# Altium project Pico-Pal.PrjPcb
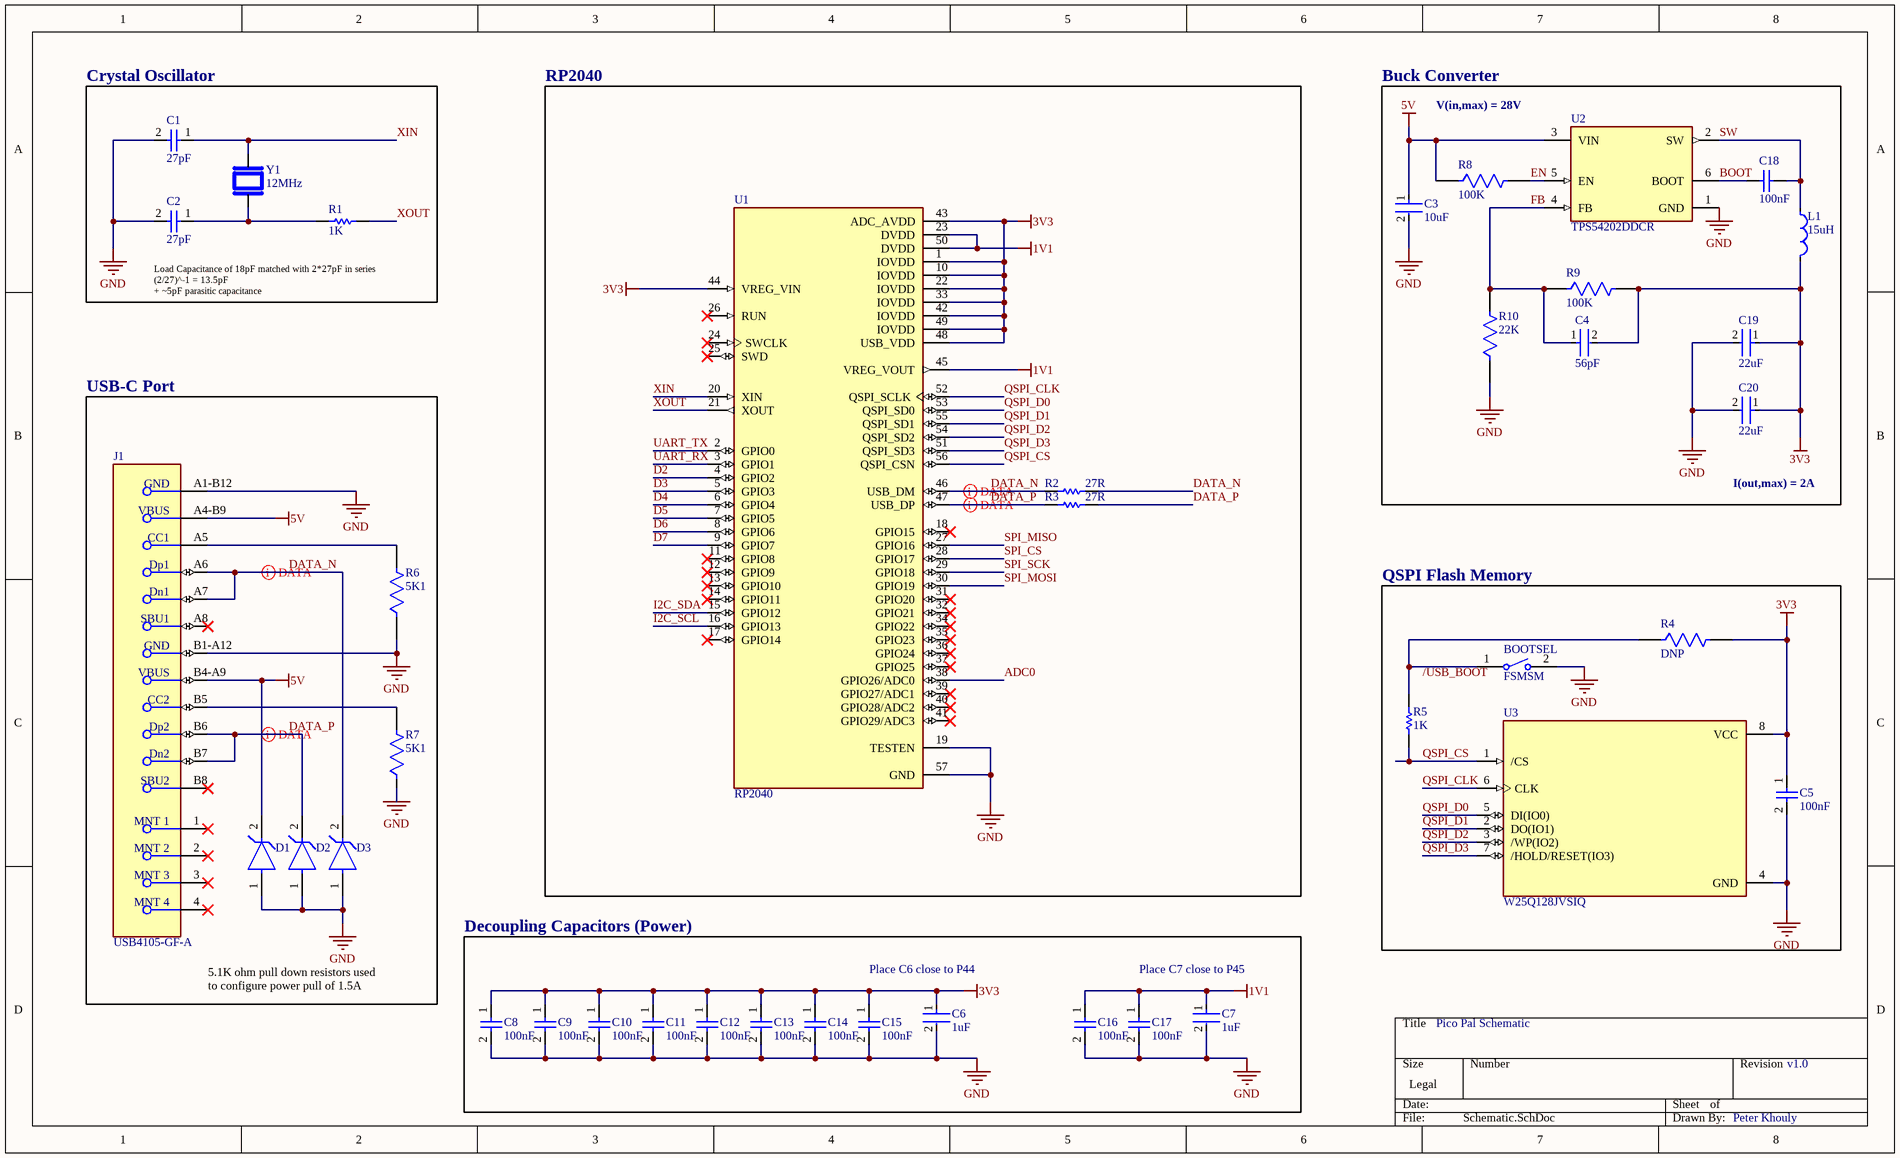
[diagram p0: Schematic.SchDoc]
1 sheet, 40 parts. Net scope: global (net labels, ports and power ports of the same name join across sheets).
Board file: PCB1.PcbDoc

## Sheet Schematic.SchDoc
size Legal; SheetNumber: 1; SheetTotal: 1

### Parts
BOOTSEL  FSMSM  [TECO-FSMSM-2_V]
C1  27pF  [CAPC1005X55X25LL05T10]
C2  27pF  [CAPC1005X55X25LL05T10]
C3  10uF  [FP-GRM15-0_2-MFG]
C4  56pF  [FP-0402-L_1_0_1-W_0_5_0_1-MFG]
C5  100nF  [CAPC1005X56X25LL10T15]
C6  1uF  [FP-GRM15-0_1-MFG]
C7  1uF  [FP-GRM15-0_1-MFG]
C8  100nF  [CAPC1005X56X25LL10T15]
C9  100nF  [CAPC1005X56X25LL10T15]
C10  100nF  [CAPC1005X56X25LL10T15]
C11  100nF  [CAPC1005X56X25LL10T15]
C12  100nF  [CAPC1005X56X25LL10T15]
C13  100nF  [CAPC1005X56X25LL10T15]
C14  100nF  [CAPC1005X56X25LL10T15]
C15  100nF  [CAPC1005X56X25LL10T15]
C16  100nF  [CAPC1005X56X25LL10T15]
C17  100nF  [CAPC1005X56X25LL10T15]
C18  100nF  [CAPC1005X56X25LL10T15]
C19  22uF  [FP-CL746-IPC_C]
C20  22uF  [FP-CL746-IPC_C]
D1  (no value)  [FP-SLP1006P2-MFG]
D2  (no value)  [FP-SLP1006P2-MFG]
D3  (no value)  [FP-SLP1006P2-MFG]
J1  USB4105-GF-A  [FP-USB4105-GF-A-MFG]
L1  15uH  [FP-MLZ2012-1_25-IPC_B]
R1  1K  [RESC1005X40X25NL05T05]
R2  27R  [RESC1005X40X25LL05T05]
R3  27R  [RESC1005X40X25LL05T05]
R4  DNP  [FP-CRCW1206-e3-IPC_C]
R5  1K  [RESC1005X40X25NL05T05]
R6  5K1  [FP-ERJ2RK-IPC_A]
R7  5K1  [FP-ERJ2RK-IPC_A]
R8  100K  [FP-ERJ2RK-IPC_C]
R9  100K  [FP-ERJ2RK-IPC_C]
R10  22K  [FP-ERJ2RK-MFG]
U1  RP2040  [QFN40P700X700X90-57N]
U2  TPS54202DDCR  [FP-DDC0006A-IPC_B]
U3  W25Q128JVSIQ  [SOIC127P790X216-8N]
Y1  12MHz  [XTAL_ABLS-12.000MHZ-B4-T]

### Blocks framed on the sheet
Crystal Oscillator: C1 C2 R1 Y1
RP2040: R2 R3 U1
Buck Converter: C3 C4 C18-C20 L1 R8-R10 U2
USB-C Port: D1-D3 J1 R6 R7
QSPI Flash Memory: BOOTSEL C5 R4 R5 U3
Decoupling Capacitors (Power): C6-C17

### Nets
1V1: C7.1 C16.1 C17.1 U1.23(DVDD) U1.45(VREG_VOUT) U1.50(DVDD)
3V3: C4.2 C5.1 C6.1 C8.1 C9.1 C10.1 C11.1 C12.1 C13.1 C14.1 C15.1 C19.1 C20.1 L1.2 R4.2 R9.2 U1.1(IOVDD) U1.10(IOVDD) U1.22(IOVDD) U1.33(IOVDD) U1.42(IOVDD) U1.43(ADC_AVDD) U1.44(VREG_VIN) U1.48(USB_VDD) U1.49(IOVDD) U3.8(VCC)
5V: C3.1 D1.2(C) J1.A4-B9(VBUS) J1.B4-A9(VBUS) R8.1 U2.3(VIN)
GND: BOOTSEL.2 C1.2 C2.2 C3.2 C5.2 C6.2 C7.2 C8.2 C9.2 C10.2 C11.2 C12.2 C13.2 C14.2 C15.2 C16.2 C17.2 C19.2 C20.2 D1.1(A) D2.1(A) D3.1(A) J1.A1-B12(GND) J1.B1-A12(GND) R6.1 R7.1 R10.1 U1.19(TESTEN) U1.57(GND) U2.1(GND) U3.4(GND)
ADC0: U1.38(GPIO26/ADC0)
BOOT: C18.2 U2.6(BOOT)
D2: U1.4(GPIO2)
D3: U1.5(GPIO3)
D4: U1.6(GPIO4)
D5: U1.7(GPIO5)
D6: U1.8(GPIO6)
D7: U1.9(GPIO7)
DATA_N: D3.2(C) J1.A6(Dp1) J1.A7(Dn1) R2.1 R2.2 U1.46(USB_DM)
DATA_P: D2.2(C) J1.B6(Dp2) J1.B7(Dn2) R3.1 R3.2 U1.47(USB_DP)
EN: R8.2 U2.5(EN)
FB: C4.1 R9.1 R10.2 U2.4(FB)
I2C_SCL: U1.16(GPIO13)
I2C_SDA: U1.15(GPIO12)
QSPI_CLK: U1.52(QSPI_SCLK) U3.6(CLK)
QSPI_CS: R5.1 U1.56(QSPI_CSN) U3.1(/CS)
QSPI_D0: U1.53(QSPI_SD0) U3.5(DI(IO0))
QSPI_D1: U1.55(QSPI_SD1) U3.2(DO(IO1))
QSPI_D2: U1.54(QSPI_SD2) U3.3(/WP(IO2))
QSPI_D3: U1.51(QSPI_SD3) U3.7(/HOLD/RESET(IO3))
SPI_CS: U1.28(GPIO17)
SPI_MISO: U1.27(GPIO16)
SPI_MOSI: U1.30(GPIO19)
SPI_SCK: U1.29(GPIO18)
SW: C18.1 L1.1 U2.2(SW)
UART_RX: U1.3(GPIO1)
UART_TX: U1.2(GPIO0)
XIN: C1.1 U1.20(XIN) Y1.2
XOUT: R1.2 U1.21(XOUT)
NetBOOTSEL_1: BOOTSEL.1 R4.1 R5.2
NetC2_1: C2.1 R1.1 Y1.1
NetJ1_A5: J1.A5(CC1) R6.2
NetJ1_B5: J1.B5(CC2) R7.2

Not connected (* = marked no-connect by the designer): J1 1(MNT_1)* 2(MNT_2)* 3(MNT_3)* 4(MNT_4)* A8(SBU1)* B8(SBU2)*; U1 11(GPIO8)* 12(GPIO9)* 13(GPIO10)* 14(GPIO11)* 17(GPIO14)* 18(GPIO15)* 24(SWCLK)* 25(SWD)* 26(RUN)* 31(GPIO20)* 32(GPIO21)* 34(GPIO22)* 35(GPIO23)* 36(GPIO24)* 37(GPIO25)* 39(GPIO27/ADC1)* 40(GPIO28/ADC2)* 41(GPIO29/ADC3)*

### Layout directives
differential pair; differential pair class DATA: DATA_N, DATA_P

### Notes on the sheet
- V(in,max) = 28V
- Load Capacitance of 18pF matched with 2*27pF in series
  (2/27)^-1 = 13.5pF
  + ~5pF parasitic capacitance
- I(out,max) = 2A
- Place C6 close to P44
- Place C7 close to P45
- 5.1K ohm pull down resistors used to configure power pull of 1.5A
- Pico Pal Schematic
- v1.0
- Peter Khouly
- Labels drawn without touching a wire or pin: /USB_BOOT

### Library data of the parts
BOOTSEL = CMP-2000-07511-1: FSMSM Push Button Switch, 50 mA, -35 to 85 degC, 2-Pin SMD, RoHS, Bulk; Manufacturer: TE Connectivity; Actuator Length: 1.07mm; Electrical Life: 20000Cycles; Actuator Material: Polyamide; Current Rating: 50mA; Illumination Type: Illuminated; Voltage Rating (DC): 24V; Contact Resistance: 100mOhm; Case\/Package: SMD/SMT; Operating Force: 180gf; Switch Travel: 0.25mm; Max Voltage Rating (DC): 12V; Throw Configuration: SPST; Packaging: LoosePiece; Max Operating Temperature: 85degC; ELV: Compliant; Package Description: 2-Pin Surface Mount Device, Body 6 x 3.5 mm, Pitch 9.19 mm; RoHSCompliant: true; Manufacturer URL: http://www.te.com/; Contact Plating: Silver; Contact Material: Brass; Mounting Technology: SurfaceMount; Contact Current Rating: 50mA; Datasheet Version: Rev. C2, 08/2014; Datasheet URL: http://www.te.com/commerce/DocumentDelivery/DDEController?Action=showdoc&DocId=Customer+Drawing%7F1437566-3%7FC2%7Fpdf%7FEnglish%7FENG_CD_1437566-3_C2_1437566_3_1_c.dwg.pdf%7F1437566-3; Mechanical Life: 20000Cycles; Package Reference: FSMSM; REACH SVHC: Unknown; Orientation: Straight; Min Operating Temperature: -35degC; Lead Free: LeadFree; Termination: GullWing; Package Quantity: 1000; Mount: SurfaceMount
C1 C2 = CMP-2008-03917-1: Part Number: GRM1555C1H270JA01D; Manufacturer: Murata
C3 = CMP-06035-000074-1: CAP CER 10UF 6.3V X6S 0402; Manufacturer Part Number: GRM155C80J106ME11D; Manufacturer: Murata; Tolerance: 20%; Material: Ceramic; Temperature Coefficient: 22%; ComponentLink2Description: Datasheet; Temperature Characteristic: X6S; RoHS: TRUE; Value: 10uF; Temperature: -55°C to +105°C; Device Class L2: Capacitors; Height: 0.7mm; Category: Cap; Device Class L1: Passive Components; Temperature Range Low: -55°C; Automotive: No; Mouser Description: Cap Ceramic 10uF 6.3V X6S 20% Pad SMD 0402 105C T/R; ComponentLink2URL: https://search.murata.co.jp/Ceramy/image/img/A01X/G101/ENG/GRM155C80J106ME11-01.pdf; Voltage Rating: 6.3V; Ipc Land Pattern Name: CAPC10050X50; Lead Free: Yes; Octopart: https://octopart.com/grm155c80j106me11d-murata-71220993; Digikey Description: CAP CER 10UF 6.3V X6S 0402; Temperature Range High: +105°C; Capacitance: 10uF; Package: GRM15-0.2; Device Class L3: Ceramic Capacitors
C4 = CMP-2008-02663-2: General Purpose Ceramic Capacitor, 0402, 56pF, 5%, C0G, 30ppm/°C, 50V; Package Quantity: 1; Dielectric: C0G; Dielectric Material: Ceramic; REACH SVHC: No SVHC; Capacitance: 56pF; Case Code (Imperial): 0402; Max Operating Temperature: 125°C; Voltage Rating: 50V; Contact Plating: Tin; Thickness: 0.022inch; Number of Pins: 2; Length: 1mm; Voltage Rating (DC): 50V; Tolerance: 5%; Case/Package: 0402; Construction: Flat; RoHS Compliant: Yes; Case Code (Metric): 1005; Width: 0.02inch; Series: -; Voltage: 50V; Packaging: Tape and Reel; Radiation Hardening: No; Depth: 0.5mm; Lead Free: Lead Free; Mount: Surface Mount; Termination: SMD/SMT; Height: 0.5mm; Temperature Coefficient: 0ppm/°C; Min Operating Temperature: -55°C
C5 C8-C18 = CMP-2008-02743-1: Manufacturer: AVX Interconnect / Elco; Part Number: 04026D104KAT2A
C6 C7 = CMP-2008-04556-2: CAP CER 1UF 10V X5R 0402; Manufacturer Part Number: GRM155R61A105KE15D; Manufacturer: Murata; Material: Ceramic; Tolerance: 10%; Temperature Coefficient: 15%; Octopart: https://octopart.com/grm155r61a105ke15d-murata-197442; Lead Free: Yes; ComponentLink2Description: Datasheet; Temperature: -55°C to +85°C; Temperature Range High: +85°C; Height: 0.55mm; Capacitance: 1uF; Ipc Land Pattern Name: CAPC10050X50; ComponentLink2URL: https://search.murata.co.jp/Ceramy/image/img/A01X/G101/ENG/GRM155R61A105KE15-01A.pdf; Temperature Range Low: -55°C; Device Class L2: Capacitors; Voltage Rating: 10V; RoHS: TRUE; Device Class L1: Passive Components; Device Class L3: Ceramic Capacitors; Temperature Characteristic: X5R; Mouser Description: 0402 1 uF 10 V ±10% Tolerance X5R Surface Mount Multilayer Ceramic Capacitor; Automotive: No; Package: GRM15-0.1; Digikey Description: CAP CER 1UF 10V X5R 0402; Value: 1uF; Category: Cap
C19 C20 = CMP-13271-000286-1: Cap Ceramic 22uF 6.3V X5R ±20% SMD 0402 +85°C Paper T/R; Case Code (Imperial): 0402; Tolerance: 20%; Width: 0.02inch; Packaging: Tape and Reel; Case/Package: 0402; Min Operating Temperature: -55°C; Max Operating Temperature: 85°C; Voltage Rating: 6.3V; Capacitance: 22uF; Thickness: 0.022inch; Mount: Surface Mount; Length: 0.039inch; Case Code (Metric): 1005
D1-D3 = CMP-56445-000005-1: TVS DIODE 33VWM 60VC SLP1006P2; Direction: Unidirectional; Min Breakdown Voltage: 36V; Leakage Current: 1uA; Peak Pulse Power: 125W; Power Line Protection: No; Number of Unidirectional Channels: 1; Clamping Voltage: 60V; Peak Pulse Current: 2A; Power Dissipation: 170W; Diode Type: ZENER; Element Configuration: Single; Reverse Standoff Voltage: 33V; Max Breakdown Voltage: 45V; Max Operating Temperature: 125°C; Resistor Type: Zener; Series: Automotive, AEC-Q100, uClamp®; Min Operating Temperature: -40°C; Case Code (Imperial): 0402; Number of Pins: 2; Lead Free: Lead Free; Case/Package: SMD/SMT; RoHS Compliant: Yes; Packaging: Tape and Reel; Clamping Voltage-Max: 60V; Depth: 0.6mm; Case Code (Metric): 1006; Length: 1mm; Radiation Hardening: No; Mount: Surface Mount; Working Voltage: 33V
J1 = CMP-245163-000001-1: CONN RCPT USB2.0 TYPEC 5A; Manufacturer: GCT; Voltage Rating: 20V; Is Female: yes; Current Rating: 5/6.25/1.25/0.25A; Number Of Contacts: 16; Conn Orientation: Right Angle; Device Class L1: Connectors; Category: Conn; Lead Free: Yes; RoHS: TRUE; Temperature Range High: +85°C; Digikey Description: CONN RCPT USB2.0 TYPEC 5A; Device Class L3: unset; ComponentLink2Description: Datasheet; Manufacturer Part Number: USB4105-GF-A; Package: 0; Usb Standard: USB 2.0; Device Class L2: USB Connectors; Automotive: No; Temperature Range Low: -40°C; Height: 3.46mm; Temperature: -40°C to +85°C; Contact Material: Gold,Nickel; ComponentLink2URL: https://gct.co/files/drawings/usb4105.pdf; Octopart: https://octopart.com/usb4105-gf-a-gct-106627878
L1 = CMP-08253-000108-1: Shielded Multilayer Inductor 15uH ±20% 350mA 611mΩ SMD 0805; Core Material: Ferrite; DC Resistance (DCR): 611mR; Test Frequency: 2MHz; Saturation Current: 90mA; Self Resonant Frequency: 40MHz; Mount: Surface Mount; Height - Seated (Max): 0.057inch; Case/Package: 0805; Case Code (Imperial): 0805; Width: 0.049inch; Current Rating: 350mA; Case Code (Metric): 2012; Max Operating Temperature: 125°C; Packaging: Tape and Reel; Length: 0.079inch; Inductance: 15uH; Shielding: Shielded; RoHS Compliant: Yes; Min Operating Temperature: -55°C; Tolerance: 20%; Package Quantity: 1
R1 R5 = CMP-1011-00510-4: Chip Resistor, 1 KOhm, +/- 1%, 100 mW, -55 to 155 degC, 0402 (1005 Metric), RoHS, Tape and Reel; PartNumber: ERJ-2RKF1001X; Manufacturer: Basic Passives; Voltage Rating: 50 V; Case\/Package: 0402; Resistance: 1 KOhm; Power Rating: 100 mW; DatasheetVersion: 04/2015; Radiation Hardening: No; Pins: 2; Height: 0.35 mm; RoHSCompliant: true; Case Code (Imperial): 0402; ComponentLink2Description: Datasheet; ComponentLink1Description: Manufacturer URL; PackageReference: 0402; Mount: Surface Mount; Package Quantity: 10000; Tolerance: 1%; ComponentLink1URL: http://www.panasonic.com/; PackageDescription: 2-Pin Surface Mount Device, Body 1 x 0.5 mm; Mounting Technology: Surface Mount; Case Code (Metric): 1005; ComponentLink2URL: http://industrial.panasonic.com/cdbs/www-data/pdf/RDA0000/AOA0000C86.pdf; REACH SVHC: Yes; Packaging: Tape and Reel; Max Operating Temperature: 155 degC; Min Operating Temperature: -55 degC; Width: 0.5 mm; Length: 1 mm
R2 R3 = CMP-2002-00498-1: Manufacturer: Panasonic; Part Number: ERJ-2GEJ270X
R4 = CMP-2003-04807-2: RES Thick Film, 10kΩ, 1%, 0.25W, 100ppm/°C, 1206; Working Voltage: 200V; Max Power Dissipation: 250mW; Resistance: 10kR; Tolerance: 1%; Width: 0.063inch; Height: 0.55mm; Number of Pins: 2; Voltage Rating: 200V; Temperature Coefficient: 100ppm/°C; Military Standard: Not; Features: Automotive AEC-Q200; Depth: 1.6mm; Radiation Hardening: No; Termination: SMD/SMT; Case Code (Imperial): 1206; Weight: 0.000353oz; Length: 3.2mm; Package Quantity: 10; Voltage Rating (DC): 200V; Case/Package: 1206; Min Operating Temperature: -55°C; Number of Terminations: 2; Composition: Thick Film; Contact Plating: Tin; Power Rating: 250mW; Packaging: Tape and Reel; Max Operating Temperature: 155°C; Lead Free: Lead Free; Case Code (Metric): 3216
R6 R7 = CMP-2002-01158-2: RES SMD 5.1K OHM 1% 1/10W 0402; Voltage Rating: 50V; Temperature Coefficient: 100ppm/°C; Resistance: 5.1kR; Power Rating: 100mW; Min Operating Temperature: -55°C; Technology: THICK FILM; Military Standard: Not; Depth: 0.5mm; Contact Plating: Tin; Tolerance: 1%; Construction: Rectangular; Length: 1mm; Case/Package: 0402; Lead Free: Lead Free; RoHS Compliant: Yes; Termination: SMD/SMT; Height: 0.35mm; Max Operating Temperature: 155°C; Case Code (Imperial): 0402; Number of Terminations: 2; Packaging: Tape and Reel; Case Code (Metric): 1005; Width: 0.5mm; Max Power Dissipation: 100mW; Package Quantity: 10000; Resistance Tolerance: 1%; REACH SVHC: No SVHC; Mount: Surface Mount; Series: ERJ; Voltage Rating (DC): 50V; Weight: 2.8E-05oz; Resistor Type: Thick Film
R8 R9 = CMP-2002-00608-4: RES SMD 100K OHM 1% 1/10W 0402; Resistance: 100kR; Voltage Rating (DC): 50V; Power Rating: 100mW; Temperature Coefficient: 100ppm/°C; Case/Package: 0402; Length: 1mm; Package Quantity: 1; Radiation Hardening: No; Case Code (Metric): 1005; Contact Plating: Tin; Mount: Surface Mount; Depth: 0.5mm; Max Operating Temperature: 155°C; Lead Free: Lead Free; Width: 0.5mm; Composition: Thick Film; Case Code (Imperial): 0402; Tolerance: 1%; Termination: SMD/SMT; Number of Pins: 2; Height: 0.35mm; Voltage Rating: 50V; Military Standard: Not; REACH SVHC: No SVHC; Packaging: Tape and Reel; Min Operating Temperature: -55°C; Max Power Dissipation: 100mW; Features: Automotive AEC-Q200; Number of Terminations: 2
R10 = CMP-2002-01133-2: RES SMD 22K OHM 1% 1/10W 0402; Resistance: 22kR; Max Power Dissipation: 100mW; Voltage Rating (DC): 50V; Temperature Coefficient: 100ppm/°C; Case Code (Imperial): 0402; Military Standard: Not; Case Code (Metric): 1005; Termination: SMD/SMT; Tolerance: 1%; Width: 0.02inch; Number of Terminations: 2; Packaging: Tape and Reel; Voltage Rating: 50V; Radiation Hardening: No; REACH SVHC: No SVHC; Contact Plating: Tin; Lead Free: Lead Free; Case/Package: 0402; Power Rating: 100mW; Depth: 0.5mm; Length: 1mm; Number of Pins: 2; Max Operating Temperature: 155°C; Composition: Thick Film; Height: 0.35mm; Min Operating Temperature: -55°C; Mount: Surface Mount; Package Quantity: 10000
U1 = RP2040: RP2040 chip for Raspberry Pi Pico - ARMÂ® CortexÂ®-M0+ MCU 32-Bit; Check_prices: https://www.snapeda.com/parts/RP2040/Raspberry+Pi/view-part/?ref=eda; Value: *; Availability: In Stock; MP: RP2040; Price: None; Package: None; SnapEDA_Link: https://www.snapeda.com/parts/RP2040/Raspberry+Pi/view-part/?ref=snap; Purchase-URL: https://pricing.snapeda.com/search/part/RP2040/?ref=eda; MF: Raspberry Pi
U2 = CMP-04918-000439-1: IC REG BUCK ADJ 2A TSOT23-6; Switching Frequency: 500kHz; Quiescent Current: 40uA; Max Output Voltage: 28V; Output Configuration: Positive; Min Output Voltage: 596mV; Min Input Voltage: 4.5V; Synchronous Rectifier: Yes; Output Type: Adjustable; Number of Outputs: 1; Packaging: Tape and Reel; Case/Package: SOT-23-6; RoHS Compliant: Yes; Max Input Voltage: 28V; Max Operating Temperature: 125°C; Min Operating Temperature: -40°C; Output Current: 2A; Lead Free: Lead Free; Mount: Surface Mount
U3 = W25Q128JVSIQ: FLASH - NOR Memory IC 128Mb (16M x 8) SPI - Quad I/O, QPI, DTR 133 MHz 8-SOIC; MF: Winbond Electronics; Price: None; Purchase-URL: https://pricing.snapeda.com/search/part/W25Q128JVSIQ/?ref=eda; Check_prices: https://www.snapeda.com/parts/W25Q128JVSIQ/Winbond+Electronics/view-part/?ref=eda; Value: *; MP: W25Q128JVSIQ; Package: SOIC-8 Winbond; SnapEDA_Link: https://www.snapeda.com/parts/W25Q128JVSIQ/Winbond+Electronics/view-part/?ref=snap; Availability: In Stock
Y1 = ABLS-12.000MHZ-B4-T: HC/49US (AT49) SMD LOW PROFILE CRYSTAL; MF: Abracon LLC; Purchase-URL: https://pricing.snapeda.com/search/part/ABLS-12.000MHZ-B4-T/?ref=eda; Price: None; Package: HC-49/US Abracon LLC; Value: *; Check_prices: https://www.snapeda.com/parts/ABLS-12.000MHZ-B4-T/Abracon+LLC/view-part/?ref=eda; SnapEDA_Link: https://www.snapeda.com/parts/ABLS-12.000MHZ-B4-T/Abracon+LLC/view-part/?ref=snap; Availability: In Stock; MP: ABLS-12.000MHZ-B4-T